# EasyEDA Pro project ProPrj_Line_follow_3_2025-06-26.epro, board PCB1
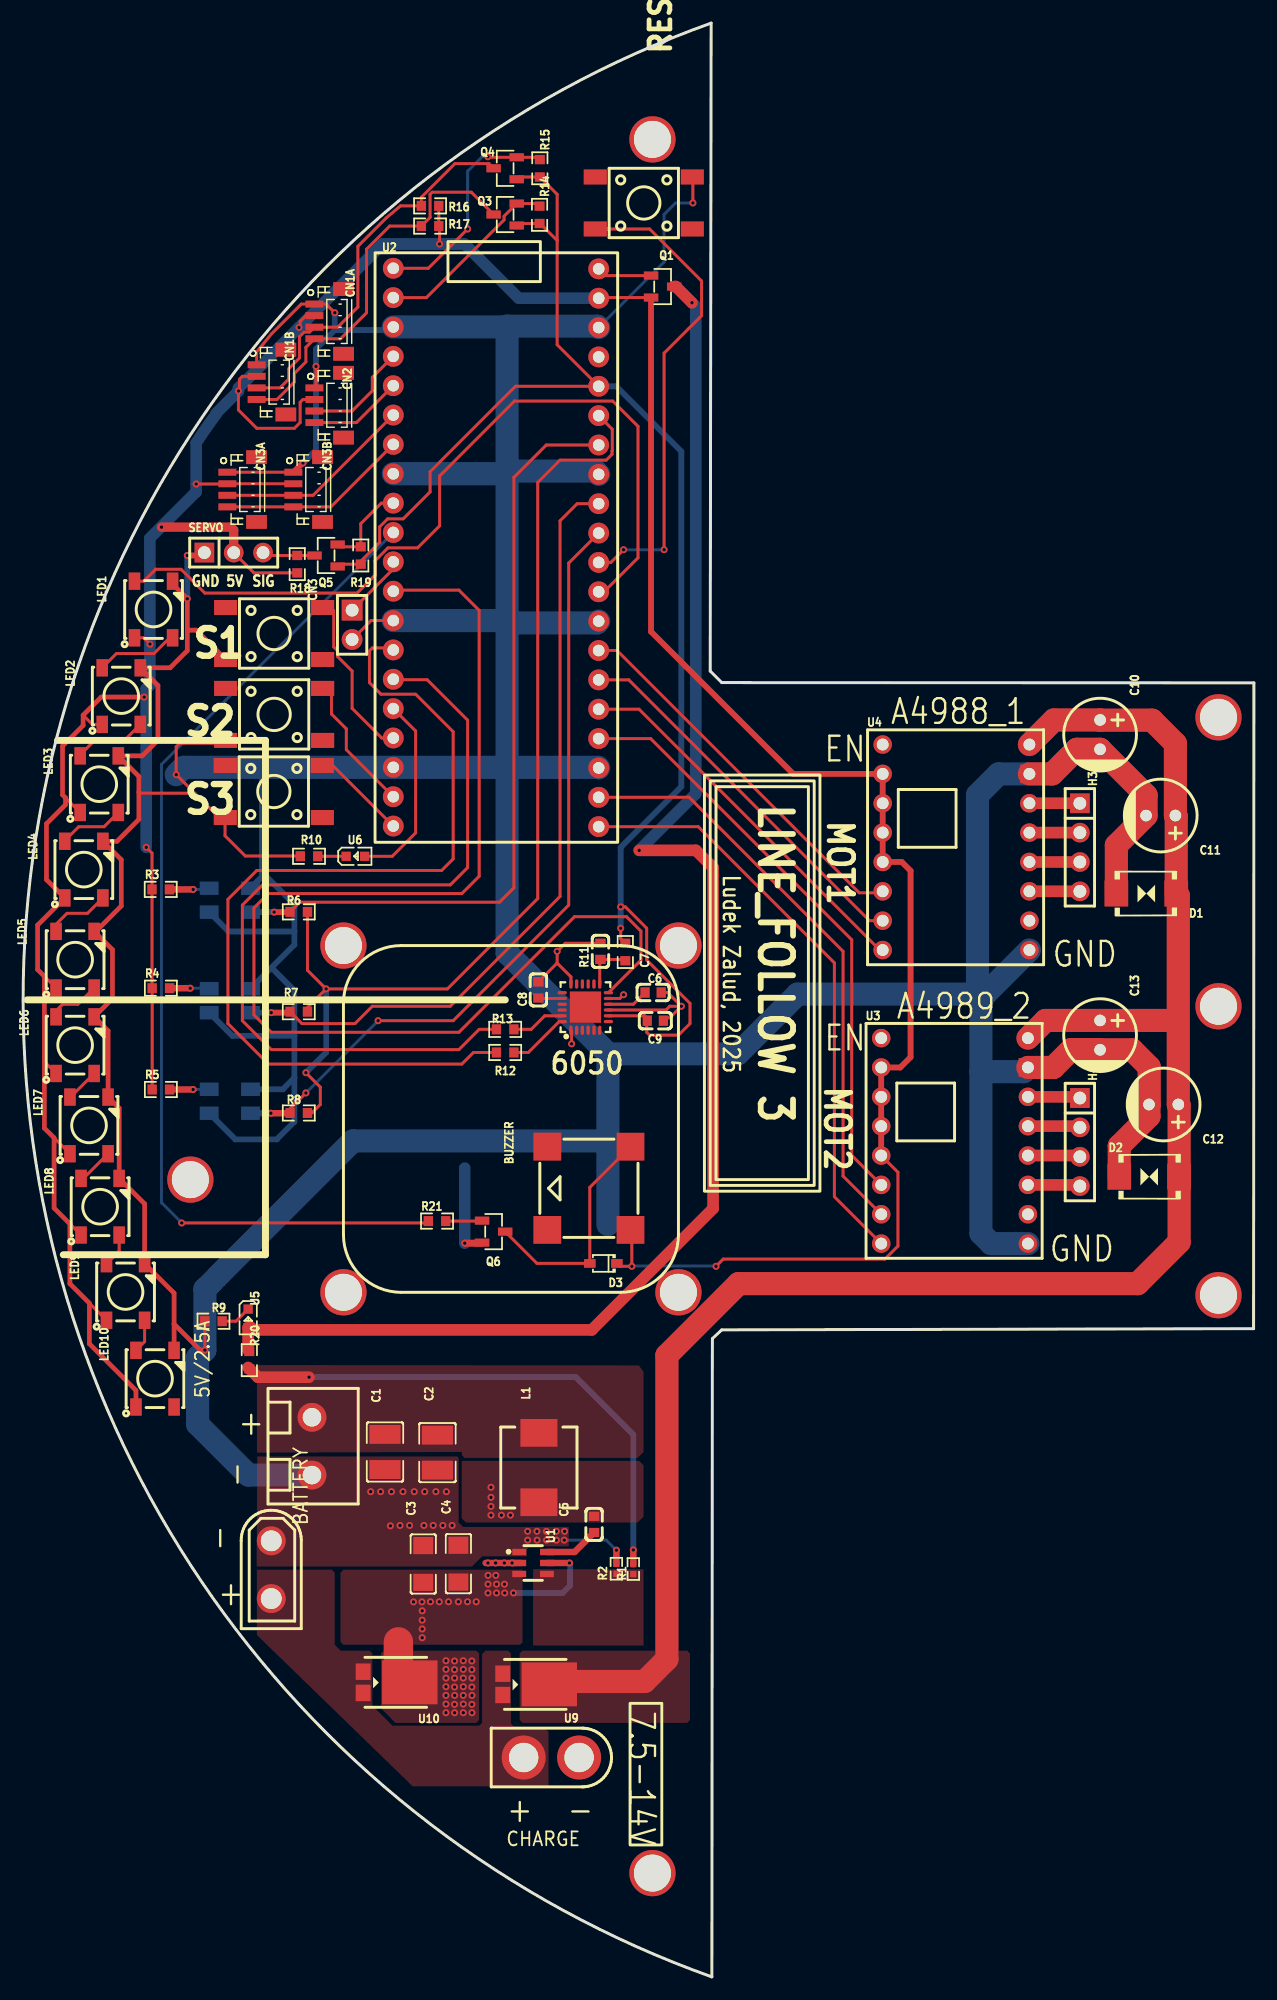
[diagram p1: board, top side]
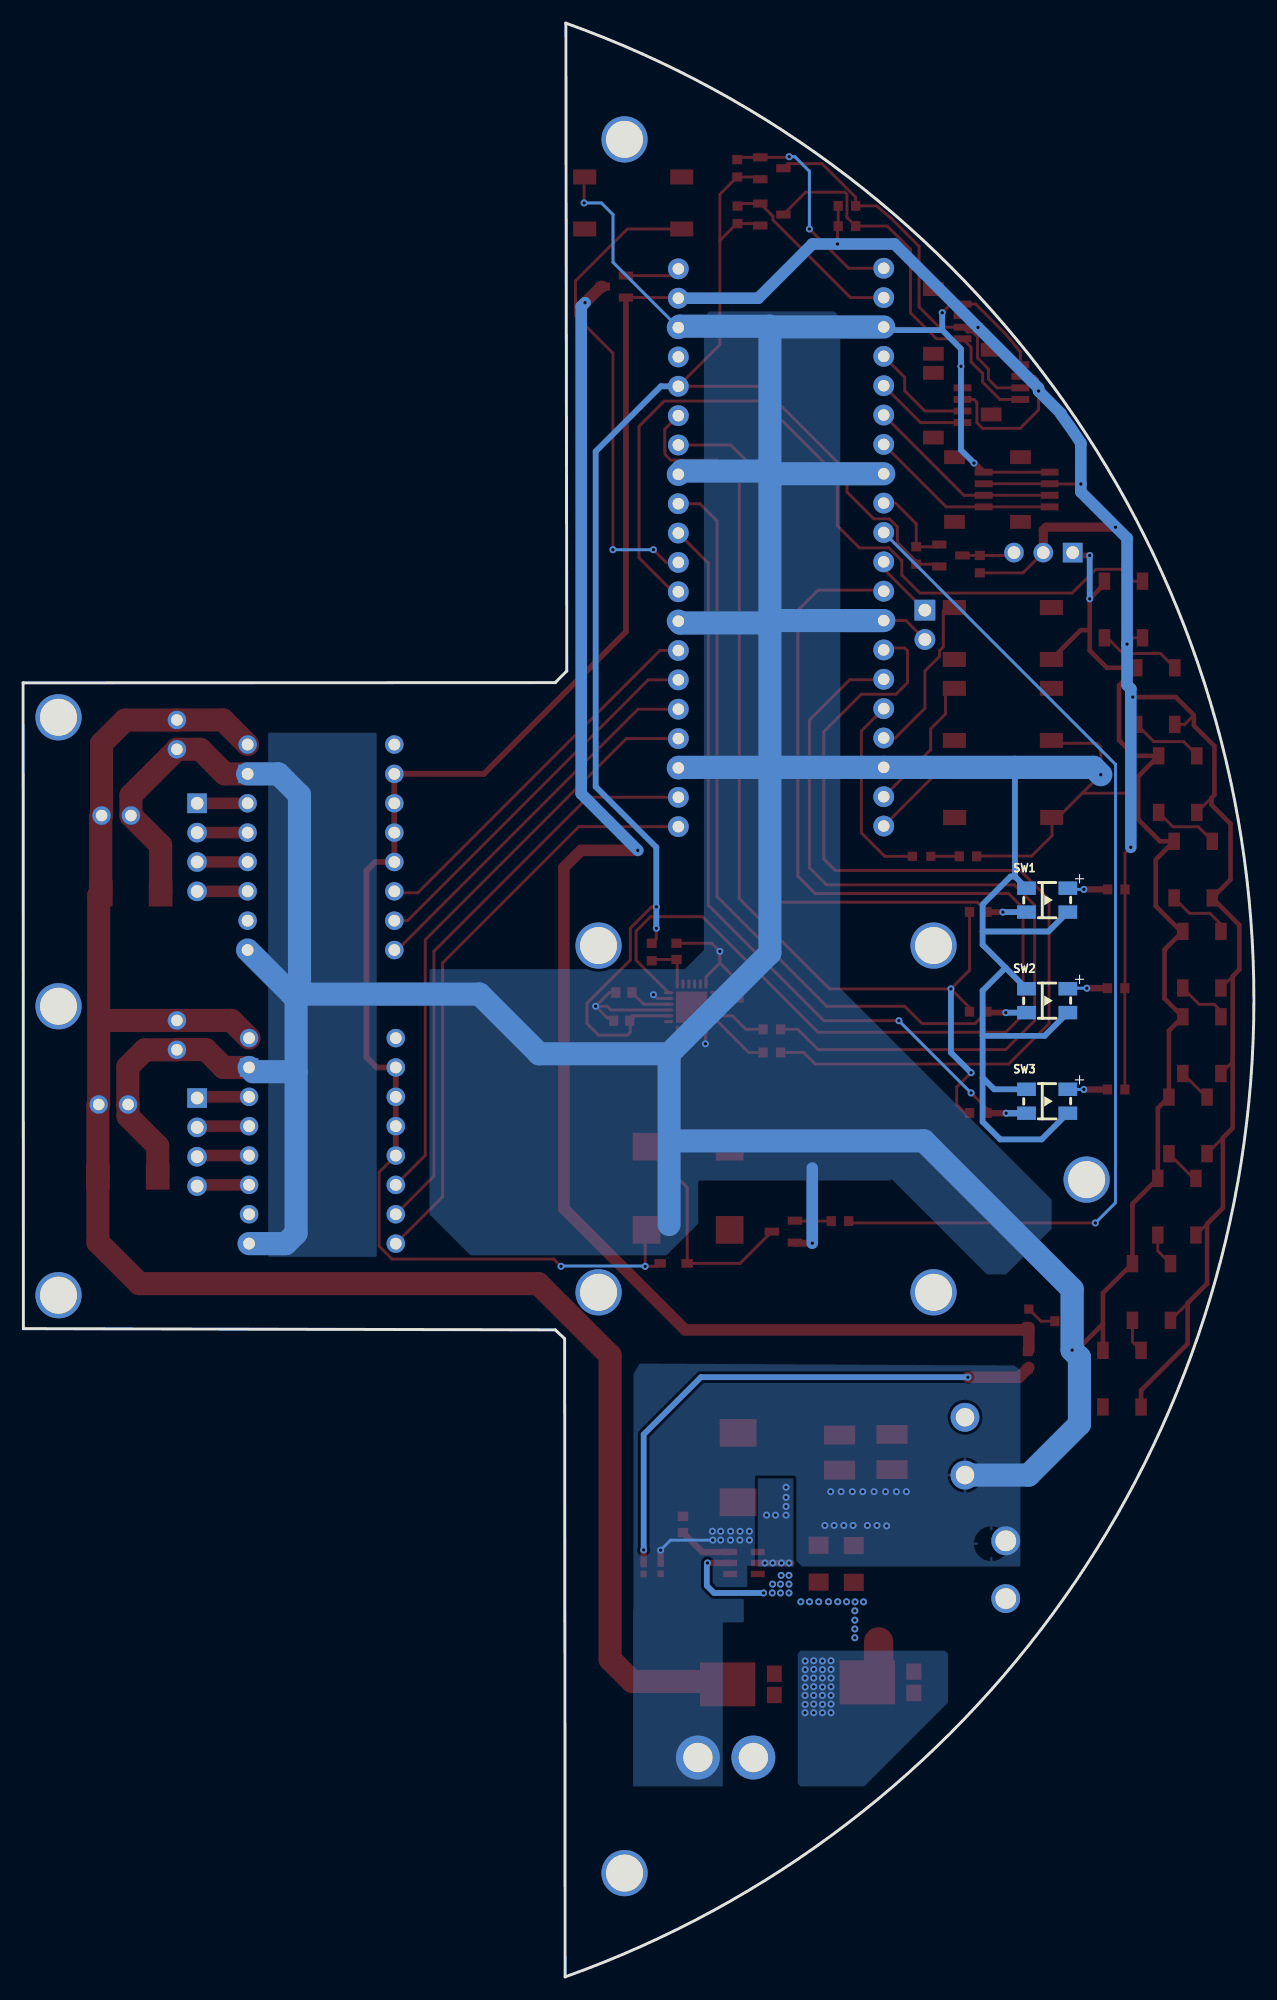
[diagram p2: board, bottom side, seen from below]

Outline 106.54 x 169.04 mm; copper layers: Top Layer, Bottom Layer. Coordinates in mm from the lower left corner of the outline.
Outline path: 59.48,112.98 59.56,169.04 arc(0,84.5) 59.62,0 59.67,55.22 60.48,55.98 106.52,56.09 106.54,111.96 60.48,111.98 59.48,112.98
Stack: Top Layer 0.035mm / Dielectric1 1.51mm FR4 er 4.5 / Bottom Layer 0.035mm

## Design rules (mm)
template: JLCPCB Capability(Two Layers Board)
spacing copperThickness1oz (default): track to track 0.102, other pairs 0.152 to 0.3
spacing copperThickness2oz: track to track 0.203, other pairs 0.152 to 0.3
track width copperThickness1oz (default): min 0.127, default 0.254, max 2.54
track width copperThickness2oz: min 0.203, default 0.254, max 2.54
differential pair differentialPair (default): width min 0.127, default 0.254, max 2.54; gap min 0.152, default 0.152
via viaSize (default): diameter min 0.5, default 0.61, max 10; hole min 0.3, default 0.305, max 6.3

## Placement (name value [footprint] x y rotation side)
5V/2.5A  DB126V-5.0-2P-GN-P  [CONN-TH_2P-P5.00_L7.8-W10.0]  25.01 45.92 270 top
6050  MPU-6050_C24112  [QFN-24_L4.0-W4.0-P0.50-BL-EP2.7]  48.67 83.9 0 top
BATTERY  XT30UPB-M  [CONN-TH_XT30UPB-M]  21.48 35.23 270 top
BUZZER  2.7kHz  [BUZ-SMD_4P-L8.5-W8.5-P8.50-BR]  48.98 68.23 90 top
C1  22uF  [C1210]  31.33 45.42 270 top
C2  22uF  [C1210]  35.87 45.36 90 top
C3  10uF  [C1206]  34.63 35.73 270 top
C4  10uF  [C1206]  37.68 35.75 270 top
C5  100nF  [C0603]  49.43 39.15 90 top
C6  100nF  [C0603]  54.54 85.17 0 top
C7  100nF  [C0603]  49.98 88.73 270 top
C8  2.2nF  [C0603]  44.61 85.39 90 top
C9  10nF  [C0603]  54.73 82.73 180 top
C10  47uF  [CAP-TH_BD6.3-P2.50-D1.0-FD]  93.23 107.48 270 top
C11  47uF  [CAP-TH_BD6.3-P2.50-D1.0-FD]  98.48 100.48 180 top
C12  47uF  [CAP-TH_BD6.3-P2.50-D1.0-FD]  98.73 75.48 180 top
C13  47uF  [CAP-TH_BD6.3-P2.50-D1.0-FD]  93.23 81.48 270 top
CHARGE  XT30U-F  [CONN-TH_XT30U-F]  45.73 18.98 0 top
CN1A  BM04B-SRSS-TB(LF)(SN)  [CONN-SMD_BM04B-SRSS-TB]  26.48 143.23 270 top
CN1B  BM04B-SRSS-TB(LF)(SN)  [CONN-SMD_BM04B-SRSS-TB]  21.48 137.98 270 top
CN2  BM04B-SRSS-TB(LF)(SN)  [CONN-SMD_BM04B-SRSS-TB]  26.48 135.98 270 top
CN3  22284020  [HDR-TH_2P-P2.54-V-M-1]  28.48 116.98 270 top
CN3A  BM04B-SRSS-TB(LF)(SN)  [CONN-SMD_BM04B-SRSS-TB]  18.94 128.69 270 top
CN3B  BM04B-SRSS-TB(LF)(SN)  [CONN-SMD_BM04B-SRSS-TB]  24.66 128.69 270 top
D1  SMBJ18CA/TR13  [SMB_L4.6-W3.6-LS5.3-BI]  97.23 93.73 180 top
D2  SMBJ18CA/TR13  [SMB_L4.6-W3.6-LS5.3-BI]  97.48 69.23 0 top
D3  1N4148WS  [SOD-323_L1.8-W1.3-LS2.5-RD]  50.23 61.73 180 top
H3  KH-2.54PH180-1X4P-L11.5  [HDR-TH_4P-P2.54-V-M]  91.48 97.73 270 top
H4  KH-2.54PH180-1X4P-L11.5  [HDR-TH_4P-P2.54-V-M]  91.48 72.23 270 top
L1  4.7uH  [IND-SMD_L7.0-W6.6]  44.65 44.07 90 top
LED1  WS2812B-B/T  [LED-SMD_4P-L5.0-W5.0-TL_WS2812B-B]  11.29 118.31 90 top
LED2  WS2812B-B/T  [LED-SMD_4P-L5.0-W5.0-TL_WS2812B-B]  8.5 110.81 90 top
LED3  WS2812B-B/T  [LED-SMD_4P-L5.0-W5.0-TL_WS2812B-B]  6.59 103.19 90 top
LED4  WS2812B-B/T  [LED-SMD_4P-L5.0-W5.0-TL_WS2812B-B]  5.25 95.8 90 top
LED5  WS2812B-B/T  [LED-SMD_4P-L5.0-W5.0-TL_WS2812B-B]  4.5 88.01 90 top
LED6  WS2812B-B/T  [LED-SMD_4P-L5.0-W5.0-TL_WS2812B-B]  4.5 80.61 90 top
LED7  WS2812B-B/T  [LED-SMD_4P-L5.0-W5.0-TL_WS2812B-B]  5.71 73.67 90 top
LED8  WS2812B-B/T  [LED-SMD_4P-L5.0-W5.0-TL_WS2812B-B]  6.67 66.63 90 top
LED9  WS2812B-B/T  [LED-SMD_4P-L5.0-W5.0-TL_WS2812B-B]  8.87 59.26 90 top
LED10  WS2812B-B/T  [LED-SMD_4P-L5.0-W5.0-TL_WS2812B-B]  11.42 51.76 90 top
NOREF  -  [Pad_e146]  27.73 59.23 0 top
NOREF#2  -  [Pad_e834]  103.48 108.98 0 top
NOREF#3  -  [Pad_e835]  103.48 58.98 0 top
NOREF#4  -  [Pad_e651]  56.73 89.23 0 top
NOREF#5  -  [Pad_e837]  14.48 68.98 0 top
NOREF#6  -  [Pad_e171]  56.73 59.23 0 top
NOREF#7  -  [Pad_e833]  54.48 158.98 0 top
NOREF#8  -  [Pad_e144]  27.73 89.23 0 top
NOREF#9  -  [Pad_e832]  54.48 8.98 0 top
NOREF#10  -  [Pad_e836]  103.48 83.98 0 top
Q1  SI2305ADS  [SOT-23-3_L2.9-W1.3-P1.90-LS2.4-BR]  55.36 146.25 180 top
Q3  BSS138LT3G-ES  [SOT-23-3_L2.9-W1.3-P1.90-LS2.4-BR]  41.73 152.48 0 top
Q4  BSS138LT3G-ES  [SOT-23-3_L2.9-W1.3-P1.90-LS2.4-BR]  41.73 156.48 0 top
Q5  BSS138LT3G-ES  [SOT-23-3_L2.9-W1.3-P1.90-LS2.4-BR]  26.23 122.98 0 top
Q6  2SC3356  [SOT-23-3_L2.9-W1.3-P1.90-LS2.4-BR]  40.73 64.48 180 top
R1  56.2kΩ  [R0402]  52.82 35.29 90 top
R2  10kΩ  [R0402]  51.36 35.31 270 top
R3  330Ω  [R0603]  11.91 94.09 0 top
R4  330Ω  [R0603]  11.93 85.54 0 top
R5  330Ω  [R0603]  11.93 76.78 0 top
R6  33kΩ  [R0603]  23.86 92.14 180 top
R7  33kΩ  [R0603]  23.86 83.51 180 top
R8  33kΩ  [R0603]  23.86 74.75 0 top
R9  620Ω  [R0603]  16.48 56.73 180 top
R10  120Ω  [R0603]  24.75 96.96 0 top
R11  0Ω  [R0603]  52.13 88.67 90 top
R12  0Ω  [R0603]  41.73 79.98 180 top
R13  0Ω  [R0603]  41.73 81.98 180 top
R14  10kΩ  [R0603]  44.71 152.45 270 top
R15  10kΩ  [R0603]  44.73 156.48 270 top
R16  10kΩ  [R0603]  35.23 153.23 0 top
R17  10kΩ  [R0603]  35.23 151.48 0 top
R18  10kΩ  [R0603]  23.73 122.23 270 top
R19  10kΩ  [R0603]  29.23 122.98 270 top
R20  0Ω  [R0603]  19.58 53.36 90 top
R21  470Ω  [R0603]  35.83 65.39 0 top
RESET  KH-6X6X6H-STM  [SW-SMD_4P-L6.0-W6.0-P4.50-LS9.0-3]  53.73 153.48 0 top
S1  KH-6X6X6H-STM  [SW-SMD_4P-L6.0-W6.0-P4.50-LS9.0-3]  21.73 116.23 0 top
S2  KH-6X6X6H-STM  [SW-SMD_4P-L6.0-W6.0-P4.50-LS9.0-3]  21.73 109.23 0 top
S3  KH-6X6X6H-STM  [SW-SMD_4P-L6.0-W6.0-P4.50-LS9.0-3]  21.7 102.56 0 top
SERVO  KH-2.54PH180-1X3P-L11.5  [HDR-TH_3P-P2.54-V-M]  18.23 123.23 0 top
SW1  ITR1502SR40A/TR8  [SW-SMD_4P-L4.0-W3.0_ITR1502SR40A-TR8]  17.89 93.16 180 bottom
SW2  ITR1502SR40A/TR8  [SW-SMD_4P-L4.0-W3.0_ITR1502SR40A-TR8]  17.89 84.46 180 bottom
SW3  ITR1502SR40A/TR8  [SW-SMD_4P-L4.0-W3.0_ITR1502SR40A-TR8]  17.89 75.76 180 bottom
U1  TPS563208DDCR  [TSOT-23-6_L2.9-W1.6-P0.95-LS2.8-BL]  44.15 35.81 270 top
U2  -  [RPI_PICO_DIL]  30.47 149.17 0 top
U3  A4988  [DIP-16_L20.3-W15.2-P2.54_LS12.7_A4988]  80.63 72.33 0 top
U4  A4988  [DIP-16_L20.3-W15.2-P2.54_LS12.7_A4988]  80.76 97.73 0 top
U5  F.0603.00139/P2-0603R1TS2-06T-002  [LED0603-RD]  19.48 56.98 270 top
U6  F.0603.00026/P2-0603B1TS2-06T-001  [LED0603-RD]  28.77 96.95 0 top
U9  10S45SP  [TO-277_3P-L5.4-W4.0-LS6.5-TR-1]  43.53 25.31 180 top
U10  10S45SP  [TO-277_3P-L5.4-W4.0-LS6.5-TR-1]  31.46 25.49 180 top

## Footprints (pads in the part's own frame, mm; a bottom-side part is the same pattern mirrored in y, then rotated)
BUZ-SMD_4P-L8.5-W8.5-P8.50-BR
  rect 2.4x2.4 smd: 1(-3.6,-3.6) 2(3.6,-3.6) 3(3.599,3.599) 4(-3.6,3.6)
C0603
  rect 0.8x0.9 smd: 1(-0.7,0) 2(0.7,0)
C1206
  rect 1.485x1.728 smd: 1(-1.593,0) 2(1.593,0)
C1210
  rect 1.635x2.7 smd: 1(-1.518,0) 2(1.518,0)
CAP-TH_BD6.3-P2.50-D1.0-FD
  round 1.6 hole 1: 1(-1.27,0) 2(1.27,0)
CONN-SMD_BM04B-SRSS-TB
  rect 1.2x1.8 smd: 0(-2.8,1.262) 0(2.8,1.262)
  rect 0.6x1.55 smd: 1(-1.5,-1.262) 2(-0.5,-1.262) 3(0.5,-1.262) 4(1.5,-1.262)
CONN-TH_2P-P5.00_L7.8-W10.0
  round 2.5 hole 1.6: 1(-2.5,0) 2(2.5,0)
CONN-TH_XT30U-F
  round 3.8 hole 2.54: 1(2.4,0) 2(-2.4,0)
CONN-TH_XT30UPB-M
  round 2.5 hole 1.8: 1(-2.5,0) 2(2.5,0)
DIP-16_L20.3-W15.2-P2.54_LS12.7_A4988
  round 1.6 hole 1.02: 1(-6.35,8.89) 2(-6.35,6.35) 3(-6.35,3.81) 4(-6.35,1.27) 5(-6.35,-1.27) 6(-6.35,-3.81) 7(-6.35,-6.35) 8(-6.35,-8.89) 9(6.35,-8.89) 10(6.35,-6.35) 11(6.35,-3.81) 12(6.35,-1.27) 13(6.35,1.27) 14(6.35,3.81) 16(6.35,8.89)
  rect 1.6x1.6 hole 1.02: 15(6.35,6.35)
HDR-TH_2P-P2.54-V-M-1
  rect 1.8x1.8 hole 1.1: 1(-1.27,0)
  round 1.8 hole 1.1: 2(1.27,0)
HDR-TH_3P-P2.54-V-M
  rect 1.7x1.7 hole 1.1: 1(-2.54,0)
  round 1.7 hole 1.1: 2(0,0) 3(2.54,0)
HDR-TH_4P-P2.54-V-M
  rect 1.7x1.7 hole 1.1: 1(-3.81,0)
  round 1.7 hole 1.1: 2(-1.27,0) 3(1.27,0) 4(3.81,0)
IND-SMD_L7.0-W6.6
  rect 2.4x3.2 smd: 1(-3,0) 2(3,0)
LED0603-RD
  rect 0.8x0.8 smd: 1(-0.799,0) 2(0.799,0)
LED-SMD_4P-L5.0-W5.0-TL_WS2812B-B
  rect 1.5x1 smd: 1(-2.45,1.65) 2(-2.45,-1.65) 3(2.45,-1.65) 4(2.45,1.65)
Pad_e144
  round 4 hole 3.2: 1(0,0)
Pad_e146
  round 4 hole 3.2: 1(0,0)
Pad_e171
  round 4 hole 3.2: 1(0,0)
Pad_e651
  round 4 hole 3.2: 1(0,0)
Pad_e832
  round 4 hole 3.2: 1(0,0)
Pad_e833
  round 4 hole 3.2: 2(0,0)
Pad_e834
  round 4 hole 3.2: 3(0,0)
Pad_e835
  round 4 hole 3.2: 4(0,0)
Pad_e836
  round 4 hole 3.2: 5(0,0)
Pad_e837
  round 4 hole 3.2: 6(0,0)
QFN-24_L4.0-W4.0-P0.50-BL-EP2.7
  oval 0.28x0.8 smd: 1(-1.25,-2) 2(-0.75,-2) 3(-0.25,-2) 4(0.25,-2) 5(0.75,-2) 6(1.25,-2) 13(1.25,2) 14(0.75,2) 15(0.25,2) 16(-0.25,2) 17(-0.75,2) 18(-1.242,2)
  oval 0.8x0.28 smd: 7(2,-1.25) 8(2,-0.75) 9(2,-0.25) 10(2,0.25) 11(2,0.75) 12(2,1.25) 19(-2,1.25) 20(-2,0.75) 21(-2,0.25) 22(-2,-0.25) 23(-2,-0.75) 24(-2,-1.25)
  rect 2.7x2.7 smd: 25(0.013,0)
R0402
  rect 0.566x0.54 smd: 1(-0.433,0) 2(0.433,0)
R0603
  rect 0.806x0.864 smd: 1(-0.753,0) 2(0.753,0)
RPI_PICO_DIL
  round 1.8 hole 1: 1(1.576,-1.339) 2(1.576,-3.878) 3(1.576,-6.418) 4(1.576,-8.959) 5(1.576,-11.498) 6(1.576,-14.039) 7(1.576,-16.578) 8(1.576,-19.119) 9(1.576,-21.659) 10(1.576,-24.198) 11(1.576,-26.738) 12(1.576,-29.279) 13(1.576,-31.819) 14(1.576,-34.358) 15(1.576,-36.898) 16(1.576,-39.438) 17(1.576,-41.978) 18(1.576,-44.519) 19(1.576,-47.059) 20(1.576,-49.599) 21(19.356,-49.648) 22(19.356,-47.108) 23(19.356,-44.569) 24(19.356,-42.029) 25(19.356,-39.489) 26(19.356,-36.949) 27(19.356,-34.408) 28(19.356,-31.869) 29(19.356,-29.328) 30(19.356,-26.788) 31(19.356,-24.248) 32(19.356,-21.709) 33(19.356,-19.169) 34(19.356,-16.628) 35(19.356,-14.088) 36(19.356,-11.549) 37(19.356,-9.008) 38(19.356,-6.468) 39(19.356,-3.929) 40(19.356,-1.389)
SMB_L4.6-W3.6-LS5.3-BI
  rect 2.047x2.241 smd: 1(-2.591,0) 2(2.591,0)
SOD-323_L1.8-W1.3-LS2.5-RD
  rect 1x0.75 smd: 1(-1.173,0) 2(1.173,0)
SOT-23-3_L2.9-W1.3-P1.90-LS2.4-BR
  rect 1.25x0.7 smd: 1(1,-0.95) 2(1,0.95) 3(-1,0)
SW-SMD_4P-L4.0-W3.0_ITR1502SR40A-TR8
  rect 1.625x1.159 smd: 1(-1.788,1.035) 2(-1.788,-1.035) 3(1.788,-1.035) 4(1.788,1.035)
SW-SMD_4P-L6.0-W6.0-P4.50-LS9.0-3
  rect 2x1.3 smd: 1(-4.2,2.25) 2(4.2,2.25) 3(-4.2,-2.25) 4(4.2,-2.25)
TO-277_3P-L5.4-W4.0-LS6.5-TR-1
  rect 1.29x1.423 smd: 1(2.017,0.92) 2(2.017,-0.92)
  rect 4.8x3.8 smd: 3(-2.017,0)
TSOT-23-6_L2.9-W1.6-P0.95-LS2.8-BL
  rect 0.55x1.2 smd: 1(-0.95,-1.2) 2(0,-1.2) 3(0.95,-1.2) 4(0.95,1.2) 5(0,1.2) 6(-0.95,1.2)

## Nets
As in the schematic, except:
GND: 5V/2.5A.2 6050.1 6050.9 6050.11 6050.18 BATTERY.1 C1.2 C2.1 C3.1 C4.1 C6.2 C7.1 C8.2 C9.1 C10.2 C11.2 C12.2 C13.2 CHARGE.1 CN1A.1 CN1B.1 CN2.1 CN3.2 CN3A.1 CN3B.1 D1.2 D2.1 LED1.3 LED2.3 LED3.3 LED4.3 LED5.3 LED6.3 LED7.3 LED8.3 LED9.3 LED10.3 Q6.2 R2.1 R9.2 R10.1 RESET.2 S1.3 S2.3 S3.3 SERVO.1 SW1.1 SW1.3 SW2.1 SW2.3 SW3.1 SW3.3 U1.1 U2.3 U2.8 U2.13 U2.18 U2.23 U2.28 U2.33 U2.38 U3.9 U3.15 U4.9 U4.15
GP8: CN3.1 U2.11

Pads without a net: 6050 2 3 4 5 6 7 14 15 16 17 19 21 22 25; BUZZER 3 4; CN1A 0; CN1B 0; CN2 0; CN3A 0; CN3B 0; LED10 2; NOREF 1; NOREF#2 3; NOREF#3 4; NOREF#4 1; NOREF#5 6; NOREF#6 1; NOREF#7 2; NOREF#8 1; NOREF#9 1; NOREF#10 5; RESET 1 4; S1 1 4; S2 1 4; S3 1 4; U2 37; U3 1 10; U4 1 10

## Via types
v1: diameter 0.61, hole 0.305, Top Layer to Bottom Layer, 130 vias

## Routing (per net, layer and track width the routed paths; a pad name or vN(x,y) marks a point on that pad's centre or on a via; arc(x,y) is an arc through that point)
3V3: length 91.5
  Top Layer w0.254: R7.1 24.62,83.87 v1(26.23,85.48) ; R6.1 24.62,87.09 v1(26.23,85.48) ; v1(26.23,85.48) 36.73,85.48 44.55,93.3 44.55,129.3 46.48,131.23 50.48,131.23 50.98,131.73 50.98,132.03 51,132.05 51,133.9 U2.35 ; v1(24.48,78.23) 25.73,76.98 25.73,75.48 25,74.75 R8.2
  Bottom Layer w0.5: v1(24.48,78.23) 26.23,79.98 v1(26.23,85.48)
3V3O: length 133.4
  Top Layer w0.254: C9.2 53.98,82.68 53.98,81.73 54.23,81.48 56.73,81.48 57.73,82.48 57.73,84.23 53.98,87.98 53.98,90.73 52.13,92.58 v1(51.73,92.58) ; Q5.1 27.43,122.23 R19.2 29.23,122.48 30.86,124.11 30.86,125.46 31.56,126.15 32.9,126.15 35.23,128.48 35.23,130.23 42.62,137.62 U2.36 46.23,141.21 46.23,150.23 ; 46.23,150.23 44.76,151.7 R14.2 42.9,151.7 Q3.1 ; 46.23,150.23 46.23,154.23 R15.2 42.93,155.73 Q4.1 ; 6050.8 53.81,83.15 53.98,82.98 54.03,82.98 ; v1(51.73,90.73) 51.73,89.82 52.13,89.42
  Bottom Layer w0.5: v1(51.73,90.73) v1(51.73,92.58) 51.73,97.73 56.98,102.98 56.98,131.98 51.34,137.62 U2.36
5V_AUX: length 134.8
  Top Layer w1: Q1.3 56.5,146.25 v1(57.9,144.85) ; v1(53.33,97.47) 58.24,97.47 59.73,95.98 59.73,66.48 49.23,55.98 19.93,55.98 19.73,56.18 U5.2 19.48,54.23
  Bottom Layer w1: v1(53.33,97.47) 58.23,102.37 58.23,144.52 v1(57.9,144.85)
+5V: length 362.7
  Top Layer w0.25: CN3A.2 CN3B.2
  Top Layer w0.254: U2.39 49.88,145.3 Q1.2 ; CN1A.2 24.48,143.73 23.98,143.23 23.98,142.8 v1(23.89,142.71) ; LED1.1 10.44,115.86 v1(10.98,115.31) ; v1(10.66,97.73) 11.16,97.23 R3.1 11.16,85.55 R4.1 R5.1 ; R16.2 R17.2 36.05,151.41 v1(36.05,149.93) ; D3.1 51.65,61.48 v1(52.69,61.48) 52.69,64.52 BUZZER.1 ; R18.2 19.98,121.48 SERVO.2 ; 4.05,65.15 LED8.1 ; 3.67,102.01 LED3.1 ; 2.68,72.6 LED7.1 ; CN3A.2 17.66,129.16 v1(14.98,129.16) ; 1.84,79.18 LED6.1 ; 6.85,108.36 5.99,108.36 5.19,109.16 ; CN1B.2 18.98,138.48 18.73,138.23 18.73,137.3 v1(18.64,137.21) 18.64,135.57 20.23,133.98 23.48,133.98 23.98,134.48 23.98,136.23 24.23,136.48 CN2.2 ; 5.74,58.29 LED9.1 ; v1(59.98,61.48) 60.6,62.1 74.6,62.1 75.73,63.23 75.73,69.62 U3.5 ; 1.84,86.57 LED5.1
  Top Layer w0.4: LED10.1 9.77,50.74 5.74,54.77 5.74,58.29 4.05,59.97 4.05,65.15 2.68,66.52 2.68,72.6 1.84,73.44 1.84,86.57 1.26,87.15 1.26,91 LED4.1 2.02,94.94 2.02,99.76 3.67,101.42 3.67,102.01 3.42,102.27 3.42,106.5 5.19,108.27 5.19,109.16 6.76,110.73 v1(10.48,110.73)
  Top Layer w0.5: U3.5 U3.3 74.28,78.68 75.93,78.68 76.82,79.57 76.82,95.7 76.06,96.46 U4.5 U4.4 U4.3 U4.2 66.66,104.08 54.36,116.39 Q1.2
  Top Layer w0.8: v1(11.98,125.43) 17.98,125.43 18.23,125.17 SERVO.2
  Bottom Layer w0.254: v1(52.69,61.48) 52.72,61.51 59.95,61.51 v1(59.98,61.48)
  Bottom Layer w1: U2.39 42.91,145.24 38.21,149.93 v1(36.05,149.93) 31.11,149.93 v1(23.89,142.71) 18.64,137.46 v1(18.64,137.21) 16.69,135.26 ; v1(10.66,97.73) 10.66,111.45 10.98,111.77 v1(10.98,115.31) 10.98,124.48 14.98,128.48 v1(14.98,129.16) 14.98,132.71 arc(15.83,133.98) 16.73,135.23
GND: length 660.7
  Top Layer w0.25: CN3A.1 CN3B.1
  Top Layer w0.254: CN2.1 25.35,137.62 v1(25.35,139.35) ; 10.02,102.49 10.1,102.41 14.85,102.41 ; v1(15.74,54.23) 15.74,56.72 R9.2 ; 6050.18 47.42,86.52 46.23,87.72 ; 6050.1 47.48,81.84 v1(47.48,80.73) ; 46.23,87.72 C8.2 ; 46.23,87.72 v1(46.23,88.73) 46.93,89.43 C7.1 ; CN3.2 30.12,117.35 U2.13 ; 14.85,102.41 16.96,100.31 S3.3 17.48,100.28 17.48,98.73 19.23,96.98 23.72,96.98 24,96.71 ; 14.85,102.41 v1(13.25,104.01) 13.25,106.43 13.56,106.73 17.28,106.73 S2.3 ; v1(56.98,83.98) 55.98,82.98 55.43,82.98 ; v1(56.98,83.98) 55.98,83.98 55.65,83.65 6050.9 ; v1(56.98,83.98) 55.79,85.17 C6.2 ; RESET.2 57.98,155.68 v1(57.98,153.48) ; v1(26.98,143.98) 26.23,144.73 CN1A.1 24.07,144.73 21.53,142.19 arc(20.87,141.4) 20.22,140.6 CN1B.1 ; 6050.11 51.65,84.65 v1(51.98,84.98)
  Top Layer w0.4: 14.21,116.43 v1(14.21,119.23) 12.69,120.76 ; 14.21,116.43 14.3,116.52 14.99,116.52 S1.3 ; 14.21,116.43 14.21,114.75 12.72,113.26 LED2.3 11.67,111.74 11.67,107 10.31,105.64 LED3.3 10.02,103.86 10.02,100.15 8.13,98.25 6.9,98.25 8.5,96.66 8.5,92.65 6.3,90.46 LED5.3 7.73,88.88 7.73,84.65 LED6.3 7.36,81.86 LED7.3 8.32,75.16 LED8.3 10.52,66.88 LED9.3 13.07,59.16 13.07,56.49 ; LED10.3 13.07,56.49 ; 13.07,56.49 15.33,54.23 v1(15.74,54.23)
  Top Layer w0.5: v1(14.21,122.98) 15.44,122.98 SERVO.1 ; CN3B.1 24.28,131.07
  Top Layer w0.55: R2.1 v1(51.36,36.92)
  Top Layer w0.6: v1(38.23,63.48) 39.68,63.48 Q6.2
  Top Layer w2: D1.2 94.64,97.91 C11.2 97.21,102.23 C10.2 91.21,106.21 89.08,104.08 U4.15 ; 86.98,78.68 89.18,78.68 90.73,80.23 93.21,80.23 C13.2 96,80.21 97.48,78.73 97.48,75.5 C12.2 97.46,74.46 94.89,71.89 D2.1
  Bottom Layer w0.254: U2.38 55.48,148.36 55.48,152.48 56.48,153.48 v1(57.98,153.48) ; v1(46.84,37.79) 50.49,37.79 v1(51.36,36.92)
  Bottom Layer w0.5: 23.48,77.79 22.49,76.8 SW3.1 ; 23.48,77.79 23.48,73.98 21.96,72.46 18.37,72.46 SW3.3 ; 23.48,77.79 23.48,81.42 ; 20.69,104.65 20.69,95.2 ; 20.69,95.2 21.06,95.2 23.48,92.78 23.48,90.45 ; 20.69,95.2 SW1.1 ; v1(14.21,119.23) v1(14.21,122.98) ; v1(24.23,130.98) 25.35,132.1 v1(25.35,139.35) 25.35,140.85 26.98,142.48 ; U2.3 31.77,142.48 26.98,142.48 ; 21.5,87.31 23.48,89.3 23.48,90.45 ; 21.5,87.31 23.48,85.33 23.48,81.42 ; 21.5,87.31 SW2.1 ; 26.98,142.48 v1(26.98,143.98) ; 23.48,90.45 17.78,90.45 SW1.3 ; 23.48,81.42 18.12,81.42 SW2.3
  Bottom Layer w1: v1(38.23,63.48) 38.23,69.98
  Bottom Layer w2: 41.9,117.14 49.66,117.14 U2.28 ; 41.9,117.14 41.9,130.29 ; 41.9,117.14 41.69,117.35 U2.13 ; 41.9,117.14 41.9,104.75 41.8,104.65 ; 5V/2.5A.2 19.51,43.42 15.1,47.82 15.1,53.6 v1(15.74,54.23) 15.74,59.51 28.56,72.33 50.41,72.33 ; U2.8 41.66,130.05 41.9,130.29 ; U3.9 83.81,63.44 82.92,64.33 82.92,78.32 ; U4.15 84.44,104.08 82.62,102.26 82.62,85.03 ; 82.92,78.32 86.62,78.32 86.98,78.68 ; 82.92,78.32 82.92,85.03 ; U4.9 83.3,85.03 82.92,85.03 ; 41.9,142.82 41.9,130.29 ; 41.9,142.82 49.71,142.82 U2.38 ; 41.9,142.82 41.83,142.75 U2.3 ; 41.9,130.29 49.54,130.29 U2.33 ; 82.62,85.03 67.04,85.03 61.88,79.87 50.62,79.87 ; 82.62,85.03 82.92,85.03 ; 41.9,104.65 41.9,88.59 50.62,79.87 ; 41.9,104.65 49.77,104.65 U2.23 ; 41.9,104.65 41.8,104.65 ; 41.8,104.65 U2.18 13.89,104.65 v1(13.25,104.01) ; 50.62,79.87 50.62,65.09
  vias: v1(30.09,41.98) v1(30.95,41.98) v1(31.79,39.02) v1(31.89,41.98) v1(32.63,39.06) v1(32.88,41.98) v1(33.46,39.06) v1(33.86,41.98) v1(34.7,39.06) v1(34.76,41.98) v1(35.5,39.06) v1(35.73,41.98) v1(36.34,39.06) v1(36.64,41.98) v1(37.14,39.06) v1(43.68,38.55) v1(43.68,37.79) v1(44.48,38.55) v1(44.49,37.79) v1(45.3,38.55) v1(45.31,37.79) v1(46.16,38.55) v1(46.16,37.79) v1(46.87,38.55)
GP7: length 90.2
  Top Layer w0.254: v1(13.73,65.23) 34.92,65.23 R21.1
  Bottom Layer w0.254: U2.10 11.98,104.91 11.98,66.98 v1(13.73,65.23)
GP8: length 5.7
  Top Layer w0.254: U2.11 32.04,121.81 CN3.1
RGB: length 72.2
  Top Layer w0.254: 9.39,120.76 10.44,120.76 11.47,121.79 13.67,121.79 15.73,119.73 28.92,119.73 30.48,121.29 30.48,122.53 31.59,123.64 34.15,123.64 36.06,125.55 36.06,129.86 42.53,136.34 51.04,136.34 53.23,134.15 53.23,122.78 50.29,119.84 U2.29
UIN: length 154.5
  Top Layer w2: 99.73,82.75 C13.1 88.51,82.75 U3.16 ; 47.73,25.56 53.81,25.56 55.73,27.48 55.73,53.77 61.94,59.98 96.48,59.98 100.07,63.57 D2.2 100.07,75.41 C12.1 100,93.55 D1.1 99.82,100.41 C11.1 99.75,106.71 97.73,108.73 93.25,108.73 C10.1 89.24,108.75 U4.16
$1N406: length 47
  Top Layer w0.55: R1.2 v1(52.82,36.94)
  Top Layer w1: 19.48,52.73 20.32,51.89 v1(24.75,51.89)
  Bottom Layer w0.5: v1(24.75,51.89) 47.87,51.89 52.82,46.93 v1(52.82,36.94)
$1N407: length 3
  Top Layer w0.55: 43.07,35.81 40.04,35.81
  vias: v1(40.24,35.81) v1(40.5,42.36) v1(40.5,41.49) v1(40.5,40.71) v1(40.5,39.95) v1(40.9,35.81) v1(41.4,39.95) v1(41.66,35.81) v1(42.19,39.95) v1(42.33,35.81)
$1N1060: length 4.7
  Top Layer w1: 91.73,101.79 91.48,101.54 U4.14
$1N1064: length 4.6
  Top Layer w1: U4.13 91.73,99 91.73,99
$1N1069: length 4.6
  Top Layer w1: U4.12 91.73,96.46 91.73,96.46
$1N1074: length 4.6
  Top Layer w1: 91.73,93.92 91.73,93.92 U4.11
$1N1086: length 4.8
  Top Layer w1: 91.73,73.75 91.58,73.6 86.98,73.6
$1N1111: length 4.8
  Top Layer w1: 91.73,76.29 91.58,76.14 U3.14
$1N1115: length 4.5
  Top Layer w1: U3.12 91.38,71.06 H4.3
$1N1120: length 4.5
  Top Layer w1: H4.4 91.38,68.52 86.98,68.52
$1N1329: length 51.3
  Top Layer w0.254: U2.21 58.44,99.52 70.23,87.73 70.23,67.5 U3.8
$1N1335: length 50.8
  Top Layer w0.254: U3.7 70.98,69.29 70.98,88.73 57.65,102.06 U2.22
$1N1342: length 51.4
  Top Layer w0.254: U2.24 54.32,107.14 71.73,89.73 71.73,71.08 74.28,68.52
$1N1376: length 33.2
  Top Layer w0.254: U2.25 53.32,109.68 74.16,88.84 U4.8
$1N1382: length 33.2
  Top Layer w0.254: U2.26 52.43,112.22 73.27,91.38 U4.7
$1N1389: length 33.3
  Top Layer w0.254: U2.27 51.41,114.76 72.38,93.8 74.28,93.8 U4.6
$1N1796: length 3.2
  Top Layer w0.55: 12.92,94.09 v1(14.72,94.09)
  Bottom Layer w0.254: SW1.4 16,94.09 v1(14.72,94.09)
$1N1800: length 3.4
  Top Layer w0.55: R4.2 v1(14.47,85.54)
  Bottom Layer w0.254: SW2.4 16.06,85.54 v1(14.47,85.54)
$1N2119: length 67.7
  Top Layer w0.254: R6.2 23.95,92.98 41.23,92.98 42.48,94.23 42.48,129.73 45.29,132.54 U2.34
  Top Layer w0.5: R6.2 23.09,92.13 v1(21.73,92.13)
  Bottom Layer w0.5: SW1.2 v1(21.73,92.13)
$1N2127: length 68.3
  Top Layer w0.254: R7.2 24.14,82.48 28.73,82.48 30.23,83.98 36.98,83.98 46.48,93.48 46.48,125.98 47.96,127.46 U2.32
  Top Layer w0.5: R7.2 23.03,83.43 v1(21.48,83.43)
  Bottom Layer w0.5: SW2.2 v1(21.48,83.43)
$1N5206: length 2.9
  Top Layer w0.254: LED10.4 10.52,54.96 LED9.2
$1N5213: length 2.9
  Top Layer w0.254: LED8.2 8.32,62.81 LED9.4
$1N5220: length 3.2
  Top Layer w0.254: LED7.2 5.22,69.08 LED8.4
$1N5227: length 2.9
  Top Layer w0.254: LED6.2 4.11,76.12 LED7.4
$1N5234: length 4.6
  Top Layer w0.254: LED5.2 4.74,84.14 3.42,84.14 2.85,83.58 LED6.4
$1N5240: length 5.6
  Top Layer w0.254: LED5.4 2.85,91.07 3.8,92.02 5.57,92.02 6.9,93.35
$1N5248: length 5.7
  Top Layer w0.254: LED3.2 7.01,99.51 4.81,99.51 3.6,98.3 LED4.4
$1N5255: length 6.4
  Top Layer w0.254: LED3.4 4.94,105.73 6.08,106.88 8.66,106.88 LED2.2
$1N5262: length 6.9
  Top Layer w0.254: 6.85,113.26 8.08,114.5 11.33,114.5 12.69,115.86
$1N5322: length 13.8
  Top Layer w0.254: 26.88,118.23 26.88,115.07 27.21,114.75 27.21,114.25 28.48,112.98 28.48,109.75 31.04,107.19 U2.17
$1N5328: length 11.6
  Top Layer w0.254: U2.19 27.98,106.17 27.98,107.98 26.69,109.27 26.69,111.48
$1N5335: length 8.3
  Top Layer w0.254: U2.20 26.8,104.81 S3.2
$1N5661: length 2.7
  Top Layer w0.254: R9.1 18.43,56.73 U5.1
$1N5846: length 16.8
  Top Layer w0.254: U2.16 33.98,107.79 33.98,98.98 31.95,96.95 U6.2
$1N6491: length 17
  Top Layer w0.25: CN3B.3 17.89,128.19
  Top Layer w0.254: U2.6 25.1,128.19 CN3B.3
$1N6499: length 16.6
  Top Layer w0.25: CN3B.4 CN3A.4
  Top Layer w0.254: U2.7 26.64,127.19 CN3B.4
$1N8080: length 68.5
  Top Layer w0.254: R8.1 23.11,75.11 v1(24.48,76.48) ; v1(30.73,82.73) 37.23,82.73 47.23,92.73 47.23,122.33 U2.31
  Top Layer w0.55: R8.1 23.09,74.73 v1(21.45,74.73)
  Bottom Layer w0.254: v1(30.73,82.73) v1(24.48,76.48)
  Bottom Layer w0.55: SW3.2 v1(21.45,74.73)
$1N10018: length 2.9
  Top Layer w0.55: 13.19,76.78 v1(14.72,76.78)
  Bottom Layer w0.254: SW3.4 16.09,76.78 v1(14.72,76.78)
$1N10344: length 3.6
  Top Layer w0.254: 6050.10 52.82,84.15 C6.1
$1N10346: length 2.1
  Top Layer w0.254: C8.1 44.65,84.65 6050.20
$1N10354: length 5.3
  Top Layer w0.254: 6050.24 46.4,82.65 43.73,79.98 R12.1
$1N10355: length 4.7
  Top Layer w0.254: R13.1 43.98,81.98 45.15,83.15 6050.23
$1N10423: length 81.8
  Top Layer w0.254: U2.14 31.87,114.98 30.23,114.98 29.98,114.73 29.98,111.98 30.98,110.98 33.98,110.98 37.23,107.73 37.23,96.73 36.23,95.73 20.23,95.73 17.73,93.23 17.73,82.48 21.23,78.98 37.98,78.98 38.98,79.98 R12.2
$1N10437: length 75.3
  Top Layer w0.254: R13.2 39.48,81.98 37.73,80.23 21.48,80.23 18.98,82.73 18.98,92.73 20.73,94.48 36.98,94.48 38.48,95.98 38.48,108.73 34.98,112.23 32.08,112.23 U2.15
$1N10483: length 4.3
  Top Layer w0.254: R11.1 52.02,88.03 C7.2 49.92,87.97 6050.13
$1N10555: length 106.4
  Top Layer w0.254: 6050.12 53.48,87.97 53.48,90.48 52.23,91.73 47.73,91.73 37.73,81.73 21.48,81.73 19.98,83.23 19.98,92.48 21.23,93.73 37.98,93.73 39.48,95.23 39.48,118.23 37.73,119.98 32.13,119.98 U2.12
$1N10722: length 41.8
  Top Layer w0.254: v1(51.98,123.48) 50.88,122.38 U2.30 ; RESET.3 54.23,151.23 58.73,146.73 58.73,143.73 55.49,140.49 v1(55.49,123.48)
  Bottom Layer w0.254: v1(51.98,123.48) v1(55.49,123.48)
$1N11952: length 33.8
  Top Layer w0.254: CN1B.3 22.23,137.48 22.98,138.23 22.98,139.12 23.92,140.06 23.92,141.9 24.33,142.31 24.8,142.31 CN1A.3 27.23,142.73 28.98,144.48 28.98,149.73 31.44,152.19 arc(32.05,152.71) 32.67,153.23 R16.1 34.48,153.98 37.38,156.88 40.33,156.88 Q4.3
$1N11953: length 34.3
  Top Layer w0.254: Q3.3 38.8,154.41 35.41,154.41 35.23,154.23 35.23,152.23 R17.1 31.73,151.48 29.73,149.48 29.73,143.98 27.48,141.73 CN1A.4 24.48,140.99 24.48,139.73 23.48,138.73 23.48,137.98 21.98,136.48 CN1B.4
$1N11956: length 16.3
  Top Layer w0.254: U2.2 34.91,145.29 41.63,152.01 41.63,152.33 Q3.2 44.48,153.43 R14.1
$1N12018: length 19.7
  Top Layer w0.254: U2.1 35.08,147.83 v1(38.48,151.23) ; v1(40.23,157.48) 40.28,157.43 Q4.2 44.53,157.43 R15.1
  Bottom Layer w0.254: v1(40.23,157.48) 39.73,157.48 38.48,156.23 v1(38.48,151.23)
$1N12552: length 4.6
  Top Layer w0.254: SERVO.3 21.02,122.98 R18.1 25.23,122.98 Q5.3
$1N12566: length 7.6
  Top Layer w0.254: Q5.2 27.43,123.73 R19.1 29.23,125.73 31.01,127.51 U2.9
$1N14780: length 2.5
  Top Layer w0.254: R10.2 27.96,96.96 U6.1
$1N17347: length 12.6
  Top Layer w0.55: U1.5 v1(47.3,35.81)
  Top Layer w2.54: 32.49,25.49 32.49,28.99
  Bottom Layer w0.5: v1(42.45,33.22) 46.72,33.22 47.36,33.85 47.36,35.76 v1(47.3,35.81)
  vias: v1(33.79,32.45) v1(34.53,32.45) v1(34.55,31.67) v1(34.55,30.87) v1(34.55,30.1) v1(34.55,29.34) v1(35.26,32.45) v1(36.02,32.45) v1(36.6,27.35) v1(36.6,26.6) v1(36.6,25.85) v1(36.6,25.1) v1(36.6,24.35) v1(36.6,23.6) v1(36.6,22.85) v1(36.82,32.45) v1(37.35,27.33) v1(37.35,26.58) v1(37.35,25.85) v1(37.35,25.08) v1(37.35,24.35) v1(37.35,23.58) v1(37.35,22.85) v1(37.67,32.45) v1(38.1,27.35) v1(38.1,26.6) v1(38.1,25.85) v1(38.1,25.1) v1(38.1,24.35) v1(38.1,23.6) v1(38.1,22.85) v1(38.47,32.45) v1(38.85,27.33) v1(38.85,26.58) v1(38.85,25.85) v1(38.85,25.08) v1(38.85,24.35) v1(38.85,23.58) v1(38.85,22.85) v1(39.22,32.45) v1(40.25,34.74) v1(40.25,33.98) v1(40.25,33.22) v1(40.92,34.74) v1(40.98,33.98) v1(40.98,33.22) v1(41.67,33.98) v1(41.69,33.22)
$1N22081: length 9.5
  Top Layer w0.254: CN2.3 28.48,135.48 30.23,137.23 30.23,138.4 U2.4
$1N22089: length 8.1
  Top Layer w0.254: U2.5 28.85,134.48 CN2.4
$1N24831: length 20
  Top Layer w0.254: BUZZER.2 49.06,68.31 D3.2 44.48,61.73 Q6.3
$1N24878: length 3.2
  Top Layer w0.254: R21.2 39.69,65.39 Q6.1
$1N409: length 4.8
  Top Layer w0.55: U1.6 47.74,36.76 C5.1
$1N2274: length 4.8
  Top Layer w0.254: U2.40 50.41,147.2 54.36,147.2

## Copper pours and planes (outline as drawn; the poured copper is in the pictures)
GND on Top Layer: 20.22,45.03 47.23,45.03 47.23,35.5 20.22,35.5
GND on Bottom Layer: 75.93,107.64 85.33,107.64 85.33,62.3 75.93,62.3
GND on Bottom Layer: 71.36,87.19 71.36,65.98 67.81,62.43 50.85,62.43 48.1,65.18 48.1,68.8 47.99,68.9 31.48,68.9 31.36,69.03 23.1,60.78 21.45,60.78 17.51,64.71 17.51,67.25 35.8,85.54 35.8,143.58 36.31,144.09 47.2,144.09 47.61,143.45 47.61,88.84 49.26,87.19
GND on Bottom Layer: 45.98,31.73 53.73,31.73 53.73,16.48 45.98,16.48
GND on Bottom Layer: 44.15,30.68 53.71,30.68 53.71,52.14 53.2,53.03 53.2,53.06 20.77,52.9 20.22,52.51 20.22,35.5 39.1,35.5 39.74,36.14 39.74,43.38 43.16,43.38 43.16,35.57 43.86,35.57 43.86,33.62 44.15,33.33
UIN on Top Layer: 42.98,28.23 57.73,28.23 57.73,21.98 42.98,21.98
$1N406 on Top Layer: 20.24,52.93 53.71,52.93 53.71,44.9 20.24,44.9
$1N407 on Top Layer: 37.96,44.65 53.71,44.65 53.71,39.31 37.96,39.31
$1N407 on Bottom Layer: 39.87,43.13 42.94,43.13 42.94,35.5 39.87,35.5
$1N6464 on Top Layer: 44.15,35.26 53.71,35.26 53.71,28.68 44.15,28.68
$1N10837 on Bottom Layer: 20.13,35.06 26.98,35.06 26.98,30.73 20.13,30.73
$1N17347 on Top Layer: 27.48,35.23 43.23,35.23 43.23,28.73 27.48,28.73
$1N17347 on Top Layer: 30.98,28.23 39.48,28.23 39.48,21.98 30.98,21.98
$1N17347 on Top Layer: 23.23,35.23 43.23,35.23 43.23,30.73 23.23,30.73
$1N17347 on Bottom Layer: 28.73,35.23 43.23,35.23 43.23,28.73 28.73,28.73
$1N17347 on Bottom Layer: 26.48,28.23 39.48,28.23 39.48,16.48 26.48,16.48
$1N17367 on Top Layer: 20.23,35.23 45.48,35.23 45.48,16.48 20.23,16.48

## Text on the board
Top Silkscreen Layer: GND | 5V | SIG | Ludek Zalud, 2025 | - | 7.5-14V | + | EN | A4988_1 | A4989_2 | MOT2 | MOT1 | LINE_FOLLOW 3
